# Altium schematic sheet etna-main-mcu.SchDoc
size A4; DocumentNumber: 1; SheetNumber: 3; SheetTotal: 5; PageSetup: Record=PageOptions|CenterHorizontal=True|CenterVertical=True|PrintScale=0.73|XCorrection=1.00|YCorrection=1.00|PrintKind=1|BorderSize=5000000|LeftOffset=0|BottomOffset=0|Orientation=2|PaperLength=1000|PaperWidth=1000|Scale=100|PaperSource=15|PrintQuality=1200|MediaType=1|DitherType=10|PaperKind=A4|PrintScaleMode=1
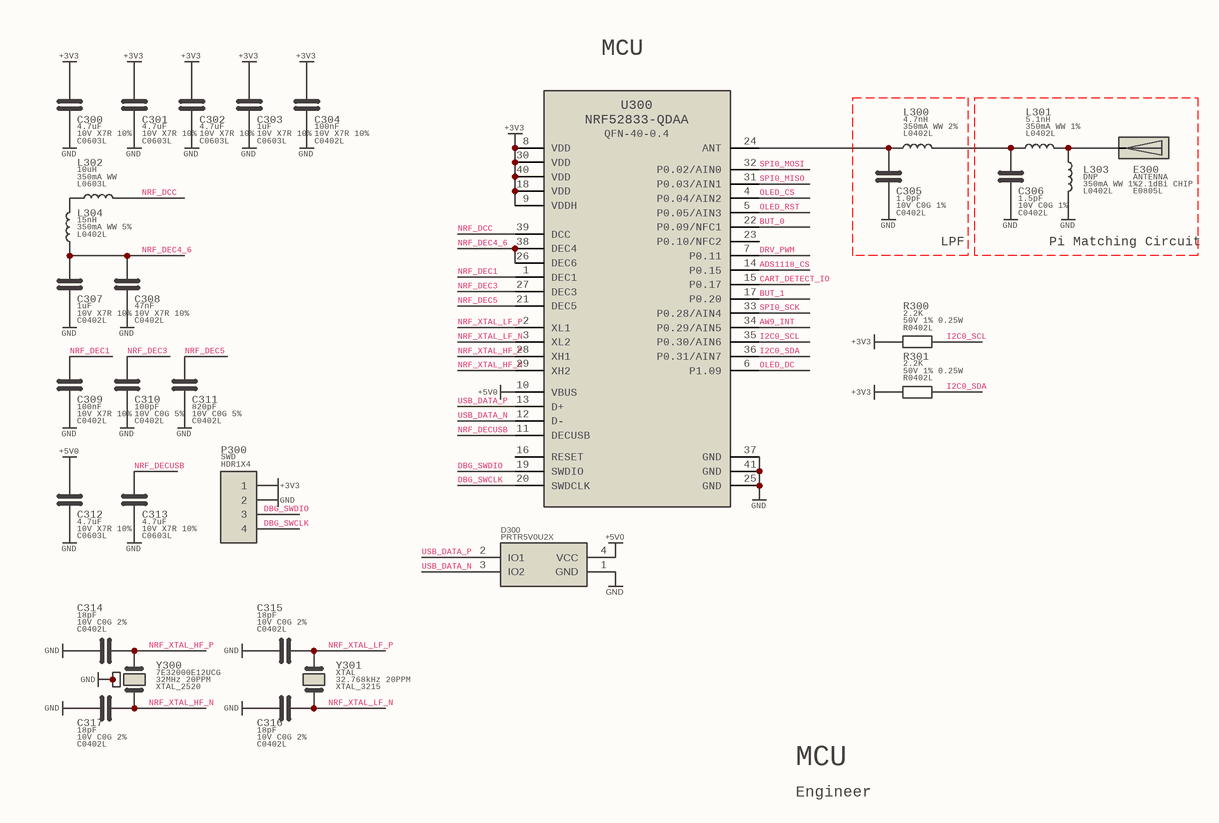
[diagram p0: etna-main-mcu.SchDoc]

## Parts
C300  value 4.7uF  Specification: 10V X7R 10%  [C0603L]
C301  value 4.7uF  Specification: 10V X7R 10%  [C0603L]
C302  value 4.7uF  Specification: 10V X7R 10%  [C0603L]
C303  value 1uF  Specification: 10V X7R 10%  [C0603L]
C304  value 100nF  Specification: 10V X7R 10%  [C0402L]
C305  value 1.0pF  Specification: 10V C0G 1%  [C0402L]
C306  value 1.5pF  Specification: 10V C0G 1%  [C0402L]
C307  value 1uF  Specification: 10V X7R 10%  [C0402L]
C308  value 47nF  Specification: 10V X7R 10%  [C0402L]
C309  value 100nF  Specification: 10V X7R 10%  [C0402L]
C310  value 100pF  Specification: 10V C0G 5%  [C0402L]
C311  value 820pF  Specification: 10V C0G 5%  [C0402L]
C312  value 4.7uF  Specification: 10V X7R 10%  [C0603L]
C313  value 4.7uF  Specification: 10V X7R 10%  [C0603L]
C314  value 18pF  Specification: 10V C0G 2%  [C0402L]
C315  value 18pF  Specification: 10V C0G 2%  [C0402L]
C316  value 18pF  Specification: 10V C0G 2%  [C0402L]
C317  value 18pF  Specification: 10V C0G 2%  [C0402L]
D300  PRTR5V0U2X  [SOT-143B]
E300  Specification: -2.1dBi CHIP  [E0805L]  (hidden comment: ANTENNA)
L300  value 4.7nH  Specification: 350mA WW 2%  [L0402L]  (hidden comment: INDUCTOR)
L301  value 5.1nH  Specification: 350mA WW 1%  [L0402L]  (hidden comment: INDUCTOR)
L302  value 10uH  Specification: 350mA WW  [L0603L]  (hidden comment: INDUCTOR)
L303  value DNP  Specification: 350mA WW 1%  [L0402L]  (hidden comment: INDUCTOR)
L304  value 15nH  Specification: 350mA WW 5%  [L0402L]  (hidden comment: INDUCTOR)
P300  value SWD  [HDR1X4]  (hidden comment: H4)
R300  value 2.2K  Specification: 50V 1% 0.25W  [R0402L]
R301  value 2.2K  Specification: 50V 1% 0.25W  [R0402L]
U300  NRF52833-QDAA  [QFN-40-0.4]
Y300  value 7E32000E12UCG  Specification: 32MHz 20PPM  [XTAL_2520]  (hidden comment: XTAL_4P)
Y301  value XTAL  Specification: 32.768kHz 20PPM  [XTAL_3215]  (hidden comment: XTAL_2P)

## Nets
+3V3: C300.1 C301.1 C302.1 C303.1 C304.1 P300.1 R300.1 R301.1 U300.8(VDD) U300.9(VDDH) U300.18(VDD) U300.30(VDD) U300.40(VDD)
+5V0: C312.1 D300.4(VCC) U300.10(VBUS)
GND: C300.2 C301.2 C302.2 C303.2 C304.2 C305.2 C306.2 C307.2 C308.2 C309.2 C310.2 C311.2 C312.2 C313.2 C314.1 C315.1 C316.1 C317.1 D300.1(GND) L303.2 P300.2 U300.25(GND) U300.37(GND) U300.41(GND) Y300.2(GND) Y300.4(GND)
ADS1118_CS: U300.14(P0.15)
AW9_INT: U300.34(P0.29/AIN5)
BUT_0: U300.22(P0.09/NFC1)
BUT_1: U300.17(P0.20)
CART_DETECT_IO: U300.15(P0.17)
DBG_SWCLK: P300.4 U300.20(SWDCLK)
DBG_SWDIO: P300.3 U300.19(SWDIO)
DRV_PWM: U300.7(P0.11)
I2C0_SCL: R300.2 U300.35(P0.30/AIN6)
I2C0_SDA: R301.2 U300.36(P0.31/AIN7)
NRF_DCC: L302.2 U300.39(DCC)
NRF_DEC1: C309.1 U300.1(DEC1)
NRF_DEC3: C310.1 U300.27(DEC3)
NRF_DEC4_6: C307.1 C308.1 L304.1 U300.26(DEC6) U300.38(DEC4)
NRF_DEC5: C311.1 U300.21(DEC5)
NRF_DECUSB: C313.1 U300.11(DECUSB)
NRF_XTAL_HF_N: C317.2 U300.29(XH2) Y300.3(OSC2)
NRF_XTAL_HF_P: C314.2 U300.28(XH1) Y300.1(OSC1)
NRF_XTAL_LF_N: C316.2 U300.3(XL2) Y301.2(OSC2)
NRF_XTAL_LF_P: C315.2 U300.2(XL1) Y301.1(OSC1)
OLED_CS: U300.4(P0.04/AIN2)
OLED_DC: U300.6(P1.09)
OLED_RST: U300.5(P0.05/AIN3)
SPI0_MISO: U300.31(P0.03/AIN1)
SPI0_MOSI: U300.32(P0.02/AIN0)
SPI0_SCK: U300.33(P0.28/AIN4)
USB_DATA_N: D300.3(IO2) U300.12(D-)
USB_DATA_P: D300.2(IO1) U300.13(D+)
NetC305_1: C305.1 L300.1 U300.24(ANT)
NetC306_1: C306.1 L300.2 L301.1
NetE300_1: E300.1(IN) L301.2 L303.1
NetL302_1: L302.1 L304.2

Not connected (* = marked no-connect by the designer): U300 16(RESET) 23(P0.10/NFC2) 44(N.C.)

## Notes on the sheet
- MCU
- LPF
- (near L303) Pi Matching Circuit
- Engineer

## Library data of the parts
C300-C317 = CAPACITOR_NONPOL
D300 = PRTR5V0U2X: Ultra low capacitance double rail-to-rail ESD protection diode
R300 R301 = RESISTOR
U300 = NRF52833-QDAA: RF System on a Chip - SoC nRF52833-QIAA QFN 40L 5x5; Value: NRF52833-QDAA
E300 = ANTENNA: Value: ANTENNA